# Altium schematic sheet [BB]PowerSuppyandMotorDriver_REV1.0.SchDoc
size B
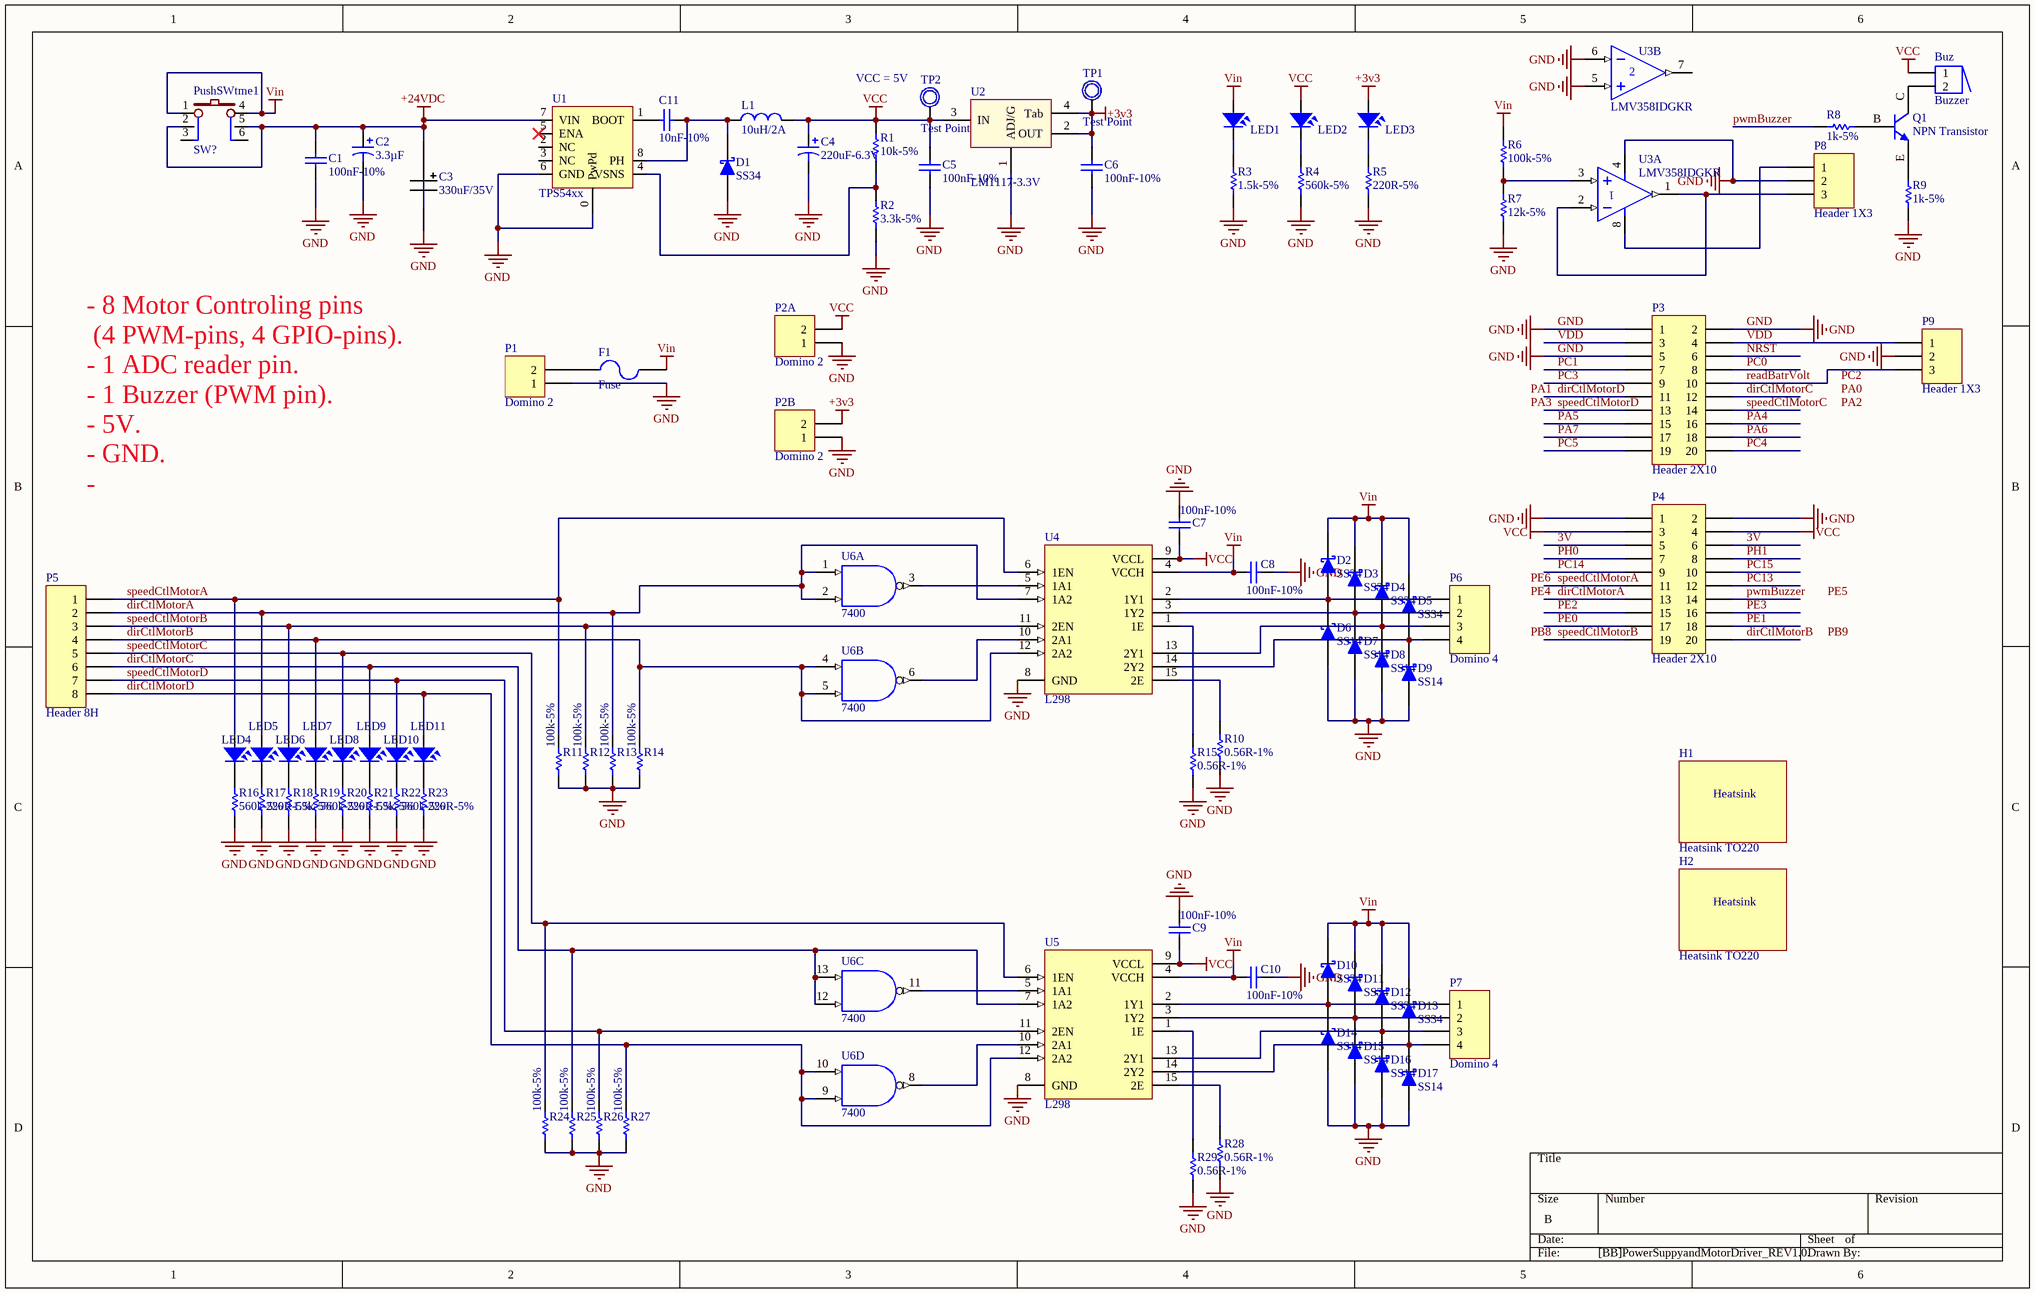
[diagram p0: [BB]PowerSuppyandMotorDriver_REV1.0.SchDoc]

## Parts
Buz  Buzzer  [BUZZER SMD]
C1  100nF-10%  [C0805]
C2  3.3µF  [SM/C_ALU_SA]
C3  330uF/35V  [Size G]
C4  220uF-6.3V  [SM/C_ALU_SD8]
C5  100nF-10%  [C0805]
C6  100nF-10%  [C0805]
C7  100nF-10%  [C0805]
C8  100nF-10%  [C0805]
C9  100nF-10%  [C0805]
C10  100nF-10%  [C0805]
C11  10nF-10%  [C0805]
D1  SS34  [DO-214AC (SMA)]
D2  SS34  [DO-214AC (SMA)]
D3  SS34  [DO-214AC (SMA)]
D4  SS34  [DO-214AC (SMA)]
D5  SS34  [DO-214AC (SMA)]
D6  SS14  [DO-214AC (SMA)]
D7  SS14  [DO-214AC (SMA)]
D8  SS14  [DO-214AC (SMA)]
D9  SS14  [DO-214AC (SMA)]
D10  SS34  [DO-214AC (SMA)]
D11  SS34  [DO-214AC (SMA)]
D12  SS34  [DO-214AC (SMA)]
D13  SS34  [DO-214AC (SMA)]
D14  SS14  [DO-214AC (SMA)]
D15  SS14  [DO-214AC (SMA)]
D16  SS14  [DO-214AC (SMA)]
D17  SS14  [DO-214AC (SMA)]
F1  Fuse  [FUSE]
H1  Heatsink TO220  [Heatsink TO-220]
H2  Heatsink TO220  [Heatsink TO-220]
L1  10uH/2A  [L6D38]
LED1  LED SMD  [SM-LED-0805-Blue]  (value not drawn)
LED2  LED SMD  [SM-LED-0805-Blue]  (value not drawn)
LED3  LED SMD  [SM-LED-0805-Blue]  (value not drawn)
LED4  LED SMD  [SM-LED-0805-Blue]  (value not drawn)
LED5  LED SMD  [SM-LED-0805-Blue]  (value not drawn)
LED6  LED SMD  [SM-LED-0805-Blue]  (value not drawn)
LED7  LED SMD  [SM-LED-0805-Blue]  (value not drawn)
LED8  LED SMD  [SM-LED-0805-Blue]  (value not drawn)
LED9  LED SMD  [SM-LED-0805-Blue]  (value not drawn)
LED10  LED SMD  [SM-LED-0805-Blue]  (value not drawn)
LED11  LED SMD  [SM-LED-0805-Blue]  (value not drawn)
P1  Domino 2  [DOMINO 2- 5mm]
P2A  Domino 2  [DOMINO 2- 5mm]
P2B  Domino 2  [DOMINO 2- 5mm]
P3  Header 2X10  [Header 2X10]
P4  Header 2X10  [Header 2X10]
P5  Header 8H  [JP8H]
P6  Domino 4  [DOMINO 4 -5mm]
P7  Domino 4  [DOMINO 4 -5mm]
P8  Header 1X3  [Header 1X3]
P9  Header 1X3  [Header 1X3]
PushSWtme1  SW?  [PUSH SW]
Q1  NPN Transistor  [SC-43-BCE]
R1  10k-5%  [R0805]
R2  3.3k-5%  [R0805]
R3  1.5k-5%  [R0805]
R4  560k-5%  [R0805]
R5  220R-5%  [R0805]
R6  100k-5%  [R0805]
R7  12k-5%  [R0805]
R8  1k-5%  [R0805]
R9  1k-5%  [R0805]
R10  0.56R-1%  [R0805]
R11  100k-5%  [R0805]
R12  100k-5%  [R0805]
R13  100k-5%  [R0805]
R14  100k-5%  [R0805]
R15  0.56R-1%  [R0805]
R16  560k-5%  [R0805]
R17  220R-5%  [R0805]
R18  1.5k-5%  [R0805]
R19  560k-5%  [R0805]
R20  220R-5%  [R0805]
R21  1.5k-5%  [R0805]
R22  560k-5%  [R0805]
R23  220R-5%  [R0805]
R24  100k-5%  [R0805]
R25  100k-5%  [R0805]
R26  100k-5%  [R0805]
R27  100k-5%  [R0805]
R28  0.56R-1%  [R0805]
R29  0.56R-1%  [R0805]
TP1  Test Point  [Hole 1.5mm]
TP2  Test Point  [Hole 1.5mm]
U1  TPS54xx  [SOIC-8 POWERPAD]
U2  LM1117-3.3V  [SOT223-4N]
U3  LMV358IDGKR  [MSOP-8]  (parts A,B of 2)
U4  L298  [DIP15SL2]
U5  L298  [DIP15SL2]
U6  7400  [SO14-150mil]  (parts A,B,C,D of 4)

## Nets
+3v3: C6.2 LED3.1 P2B.2 TP1.0 U2.2(OUT) U2.4(Tab)
+24VDC: C1.2 C2.1 C3.1 PushSWtme1.2 PushSWtme1.5 U1.7(VIN)
GND: C1.1 C2.2 C3.2 C4.2 C5.1 C6.1 C7.2 C8.1 C9.2 C10.1 D1.1(A) D6.1(A) D7.1(A) D8.1(A) D9.1(A) D14.1(A) D15.1(A) D16.1(A) D17.1(A) P1.1 P2A.1 P2B.1 P3.1 P3.2 P3.5 P4.1 P4.2 P8.2 P9.2 R2.1 R3.1 R4.1 R5.1 R7.1 R9.1 R10.1 R11.1 R12.1 R13.1 R14.1 R15.1 R16.1 R17.1 R18.1 R19.1 R20.1 R21.1 R22.1 R23.1 R24.1 R25.1 R26.1 R27.1 R28.1 R29.1 U1.0(PwPd) U1.6(GND) U2.1(ADJ/G) U3.4(V-) U3.5(IN+) U3.6(IN-) U4.8(GND) U5.8(GND) U6.7(GND)
VCC: Buz.1 C4.1 C5.2 C7.1 C9.1 L1.2 LED2.1 P2A.2 P4.3 P4.4 R1.2 TP2.0 U2.3(IN) U4.9(VCCL) U5.9(VCCL) U6.14(VCC)
Vin: C8.2 C10.2 D2.2(K) D3.2(K) D4.2(K) D5.2(K) D10.2(K) D11.2(K) D12.2(K) D13.2(K) F1.2 LED1.1 PushSWtme1.1 PushSWtme1.4 R6.2 U4.4(VCCH) U5.4(VCCH)
3V: P4.5 P4.6
dirCtlMotorA: LED5.1 P4.13 P5.2 R13.2 U4.7(1A2) U6.1(A) U6.2(B)
dirCtlMotorB: LED7.1 P4.20 P5.4 R14.2 U4.12(2A2) U6.4(A) U6.5(B)
dirCtlMotorC: LED9.1 P3.12 P5.6 R25.2 U5.7(1A2) U6.12(B) U6.13(A)
dirCtlMotorD: LED11.1 P3.11 P5.8 R27.2 U5.12(2A2) U6.9(B) U6.10(A)
NRST: P3.6
PA4: P3.16
PA5: P3.15
PA6: P3.18
PA7: P3.17
PC0: P3.8
PC1: P3.7
PC3: P3.9
PC4: P3.20
PC5: P3.19
PC13: P4.12
PC14: P4.9
PC15: P4.10
PE0: P4.17
PE1: P4.18
PE2: P4.15
PE3: P4.16
PH0: P4.7
PH1: P4.8
pwmBuzzer: P4.14 R8.1
readBatrVolt: P3.10 P9.3
speedCtlMotorA: LED4.1 P4.11 P5.1 R11.2 U4.6(1EN)
speedCtlMotorB: LED6.1 P4.19 P5.3 R12.2 U4.11(2EN)
speedCtlMotorC: LED8.1 P3.14 P5.5 R24.2 U5.6(1EN)
speedCtlMotorD: LED10.1 P3.13 P5.7 R26.2 U5.11(2EN)
VDD: P3.3 P3.4 P9.1
NetBuz_2: Buz.2 Q1.C
NetC11_1: C11.1 U1.1(BOOT)
NetC11_2: C11.2 D1.2(K) L1.1 U1.8(PH)
NetD2_1: D2.1(A) D6.2(K) P6.1 U4.2(1Y1)
NetD3_1: D3.1(A) D7.2(K) P6.2 U4.3(1Y2)
NetD4_1: D4.1(A) D8.2(K) P6.3 U4.13(2Y1)
NetD5_1: D5.1(A) D9.2(K) P6.4 U4.14(2Y2)
NetD10_1: D10.1(A) D14.2(K) P7.1 U5.2(1Y1)
NetD11_1: D11.1(A) D15.2(K) P7.2 U5.3(1Y2)
NetD12_1: D12.1(A) D16.2(K) P7.3 U5.13(2Y1)
NetD13_1: D13.1(A) D17.2(K) P7.4 U5.14(2Y2)
NetF1_1: F1.1 P1.2
NetLED1_2: LED1.2 R3.2
NetLED2_2: LED2.2 R4.2
NetLED3_2: LED3.2 R5.2
NetLED4_2: LED4.2 R16.2
NetLED5_2: LED5.2 R17.2
NetLED6_2: LED6.2 R18.2
NetLED7_2: LED7.2 R19.2
NetLED8_2: LED8.2 R20.2
NetLED9_2: LED9.2 R21.2
NetLED10_2: LED10.2 R22.2
NetLED11_2: LED11.2 R23.2
NetP8_1: P8.1 U3.8(V+)
NetP8_3: P8.3 U3.1(OUT) U3.2(IN-)
NetQ1_B: Q1.B R8.2
NetQ1_E: Q1.E R9.2
NetR1_1: R1.1 R2.2 U1.4(VSNS)
NetR6_1: R6.1 R7.2 U3.3(IN+)
NetR10_2: R10.2 U4.15(2E)
NetR15_2: R15.2 U4.1(1E)
NetR28_2: R28.2 U5.15(2E)
NetR29_2: R29.2 U5.1(1E)
NetU4_5: U4.5(1A1) U6.3(~{O})
NetU4_10: U4.10(2A1) U6.6(~{O})
NetU5_5: U5.5(1A1) U6.11(~{O})
NetU5_10: U5.10(2A1) U6.8(~{O})

Not connected (* = marked no-connect by the designer): H1 0 1; H2 0 1; PushSWtme1 3 6; U1 2(NC) 3(NC) 5(ENA)*; U3 7(OUT)

## Notes on the sheet
- VCC = 5V
- (near P1) - 8 Motor Controling pins
  (4 PWM-pins, 4 GPIO-pins).
  - 1 ADC reader pin.
  - 1 Buzzer (PWM pin).
  - 5V.
  - GND.
  -
- Labels drawn without touching a wire or pin: PA0, PA1, PA2, PA3, PB8, PB9, PC2, PE4, PE5, PE6
- (in symbol Heatsink TO220) Heatsink

## Library data of the parts
C1 C5-C10 = 100nF-50V-C0805: Non-Polarized Capacitor; Manufacturer: Yageo; Manufacturer Part Number: CC0805KRX7R9BB104; Value: 100nF-10%; Digi-Key Part Number: 311-1140-1-ND; Unit Price: 0.1
C2 = 4.7uF-25V-Tantalum: Tantalum Capacitor; Manufacturer: Panasonic Electronic Components; Manufacturer Part Number: EEE-FC1V3R3R; Tolerance: ±20%; Voltage Rating: 35V; Lifetime @ Temp.: 1000 Hrs @ 105°C; Ripple Current: 45mA; Impedance: 3 Ohm; Surface Mount Land Size: 0.169" L x 0.169" W (4.30mm x 4.30mm); Supplier 1: Digi-Key; Supplier Part Number 1: PCE4030CT-ND; RoHS: RoHS Compliant; Category: Capacitors; Stock 1: 2931; Pricing 1: 1=0.46, 10=0.363, 25=0.306, 50=0.2622, 100=0.2185, 250=0.16388, 500=0.13984, 1000=0.10925 (USD); Packaging: Cut Tape (CT); Capacitance: 3.3µF; ESR (Equivalent Series Resistance): -; Operating Temperature: -40°C ~ 105°C; Type: -; Applications: AEC-Q200; Lead Spacing: -; Size / Dimension: 0.157" Dia (4.00mm); Height - Seated (Max): 0.213" (5.40mm); Mounting Type: Surface Mount; Package / Case: Radial, Can - SMD; ComponentLink1URL: http://industrial.panasonic.com/www-cgi/jvcr13pz.cgi?E+PZ+3+ABA0005+EEEFC1V3R3R+7+WW; ComponentLink1Description: http://industrial.panasonic.com/www-cgi/jvcr13pz.cgi?E+PZ+3+ABA0005+EEEFC1V3R3R+7+WW
C3 = C_ALU_330uF_35V: CAP ALUM 330UF 20% 35V SMD; Manufacturer: Panasonic Electronic Components; Manufacturer Part Number: EEE-1VA331P; Unit Price in VND: 4000; Name: Aluminum Capacitor; Digi-Key Part Number: PCE3959CT-ND; Unit Price: 0.96; Tme Part Number: EEE-FK1C331P; Value: 330uF/35V
C4 = 220uF-6.3V-Tantalum: Tantalum Capacitor; Manufacturer: AVX Corporation; Manufacturer Part Number: TAJC227K006RNJ; Value: 220uF-6.3V; Digi-Key Part Number: 478-1713-1-ND; Unit Price: 2.1
C11 = 10nF-50V-C0805: Non-Polarized Capacitor; Manufacturer: Yageo; Manufacturer Part Number: CC0805KRX7R9BB103; Value: 10nF-10%; Digi-Key Part Number: 311-1136-1-ND; Unit Price: 0.1
D1-D17 = Diode_SS14: DIODE SCHOTTKY 40V 1A DO214AC; Manufacturer: Vishay Semiconductor Diodes Division; Manufacturer Part Number: SS14-E3/61T; Digi-Key Part Number: SS14-E3/61TGITR-ND; Unit Price: 0.07981
H1 H2 = Heatsink TO220: Heatsink-231625W Tản nhiệt Nhôm kiểu TO-220 / Multiwatt, 23x16x25mm; tme link: http://tme.vn/Product.aspx?id=1542
L1 = L6D38-100M: 10uH/2A ±20% SMD 6.7x6.7x4mm Inductor; tme: http://tme.vn/Product.aspx?id=1877; Unit price: 6000 VND; Value: 10uH/2A
LED1-LED11 = LED-SMD-0805
P1 P2A P2B = Domino 2: Domino, 2-Pin; LatestRevisionDate: 17-Jul-2002; LatestRevisionNote: Re-released for DXP Platform.; Publisher: Altium Limited
P3 P4 = Header 2X10: Header, 10-Pin, Dual row
P5 = Header 8H: Header, 8-Pin, Right Angle; LatestRevisionDate: 17-Jul-2002; LatestRevisionNote: Re-released for DXP Platform.; Publisher: Altium Limited
P6 P7 = Domino 4: Domino 4-Pin; LatestRevisionDate: 17-Jul-2002; LatestRevisionNote: Re-released for DXP Platform.; Publisher: Altium Limited
P8 P9 = Header 1X3: Header, 3-Pin
PushSWtme1 = PushSWtme: Push SW 8x8 mm latching ON/OFF
R1 = 10k-5%-R0805: RES 10k OHM 1/8W 5% 0805 SMD; Manufacturer: Yageo; Manufacturer Part Number: RC0805JR-0710KL; Digi-Key Part Number: 311-10KARTR-ND; Unit Price: 0.00209
R2 = 3.3k-5%-R0805: RES 3.3k OHM 1/8W 5% 0805 SMD; Manufacturer: Yageo; Manufacturer Part Number: RC0805JR-073K3L; Digi-Key Part Number: 311-3.3KARTR-ND; Unit Price: 0.00209
R3 R18 R21 = 1.5k-5%-R0805: RES 1.5k OHM 1/8W 5% 0805 SMD; Manufacturer: Yageo; Manufacturer Part Number: RC0805JR-071K5L; Digi-Key Part Number: 311-1.5KARTR-ND; Unit Price: 0.00209
R4 R16 R19 R22 = 560k-5%-R0603: RES 560k OHM 1/10W 5% 0603 SMD; Manufacturer: Yageo; Manufacturer Part Number: RC0603JR-07560KL; Digi-Key Part Number: 311-560KGRTR-ND; Unit Price: 0.00131
R5 R17 R20 R23 = 220R-5%-R0805: RES 220 OHM 1/8W 5% 0805 SMD; Manufacturer: Yageo; Manufacturer Part Number: RC0805JR-07220RL; Digi-Key Part Number: 311-220ARTR-ND; Unit Price: 0.00209
R6 R11-R14 R24-R27 = 100k-5%-R0805: RES 100k OHM 1/8W 5% 0805 SMD; Manufacturer: Yageo; Manufacturer Part Number: RC0805JR-07100KL; Digi-Key Part Number: 311-100KARTR-ND; Unit Price: 0.00209
R7 = 12k-5%-R0805: RES 12k OHM 1/8W 5% 0805 SMD; Manufacturer: Yageo; Manufacturer Part Number: RC0805JR-0712KL; Digi-Key Part Number: 311-12KARTR-ND; Unit Price: 0.00209
R8 R9 = 1k-5%-R0805: RES 1k OHM 1/8W 5% 0805 SMD; Manufacturer: Yageo; Manufacturer Part Number: RC0805JR-071KL; Digi-Key Part Number: 311-1.0KARTR-ND; Unit Price: 0.00209
R10 R15 R28 R29 = 0.56R-1%-R0603: RES 0.56 OHM 1/10W 1% 0603 SMD; Manufacturer: Yageo; Manufacturer Part Number: RL0603FR-070R56L; Digi-Key Part Number: 311-.56QTR-ND; Unit Price: 0.03683
U1 = TPS54xx: IC REG BUCK ADJ 1A 8SOIC; Manufacturer: Texas Instruments; Manufacturer Part Number: TPS5410DR; Unit Price: 1.6; Digi-Key Part Number: 296-26982-2-ND
U2 = LM1117-3.3V: 800mA Low-Dropout Linear Regulator; Manufacturer: Texas Instruments; Manufacturer Part Number: LM1117MPX-3.3/NOPB; Digi-Key Part Number: LM1117MPX-3.3/NOPBTR-ND; Unit Price: 0.42700; tme link: http://tme.vn/Product.aspx?id=437; Unit price: 4000 VND
U3 = LMV358IDGKR: Manufacturer: Texas Instruments; Amplifier Type: General Purpose; Number of Circuits: 2; Output Type: Rail-to-Rail; Slew Rate: 1 V/µs; Gain Bandwidth Product: 1MHz; Current - Input Bias: 15nA; Voltage - Input Offset: 1.7mV; Current - Supply: 210µA; Current - Output / Channel: 160mA; Voltage - Supply, Single/Dual (±): 2.7 V ~ 5.5 V, ±1.35 V ~ 2.75 V; Supplier 1: Digi-Key; Manufacturer Part Number: LMV358IDGKR; RoHS: RoHS Compliant; Category: Integrated Circuits (ICs); Stock 1: 1330; Pricing 1: 1=0.77, 10=0.68, 100=0.52, 500=0.412, 1000=0.33 (USD); Packaging: Cut Tape (CT); -3db Bandwidth: -; Operating Temperature: -40°C ~ 125°C; Mounting Type: Surface Mount; Package / Case: 8-TSSOP, 8-MSOP (0.118", 3.00mm Width); Supplier Device Package: 8-VSSOP; ComponentLink1URL: http://www.ti.com/lit/ds/symlink/lmv324.pdf; ComponentLink1Description: http://www.ti.com/lit/ds/symlink/lmv324.pdf; Supplier Part Number 1: 296-13455-1-ND
U4 U5 = L298: Dual Full-H Driver; Note: The tab is elec is connected to GND pin; Published: 15-May-2002; DatasheetVersion: Jun-1990; PackageReference: KV015; Publisher: Altium Limited; PackageDescription: TO, Thru-Hole, Vertical, Heatsink Mounted; 15 Bent Staggered Leads; Pitch 1.27 mm; ComponentLink1Description: Manufacturer Link; ComponentLink1URL: http://www.ti.com/
U6 = 7400: Quad 2-Input NAND Gate; Value: DIP14/W0.3; Value: 7400
F1 = Fuse: Published: 8-Jun-2000; LatestRevisionDate: 17-Jul-2002; LatestRevisionNote: Re-released for DXP Platform.; PackageReference: PIN-W2/E2.8; Publisher: Altium Limited; PackageDescription: Thru-Hole; 2 Leads
TP1 TP2 = Test Point: Value: Test Point